# Altium project 最小系统+控制.PrjPcb
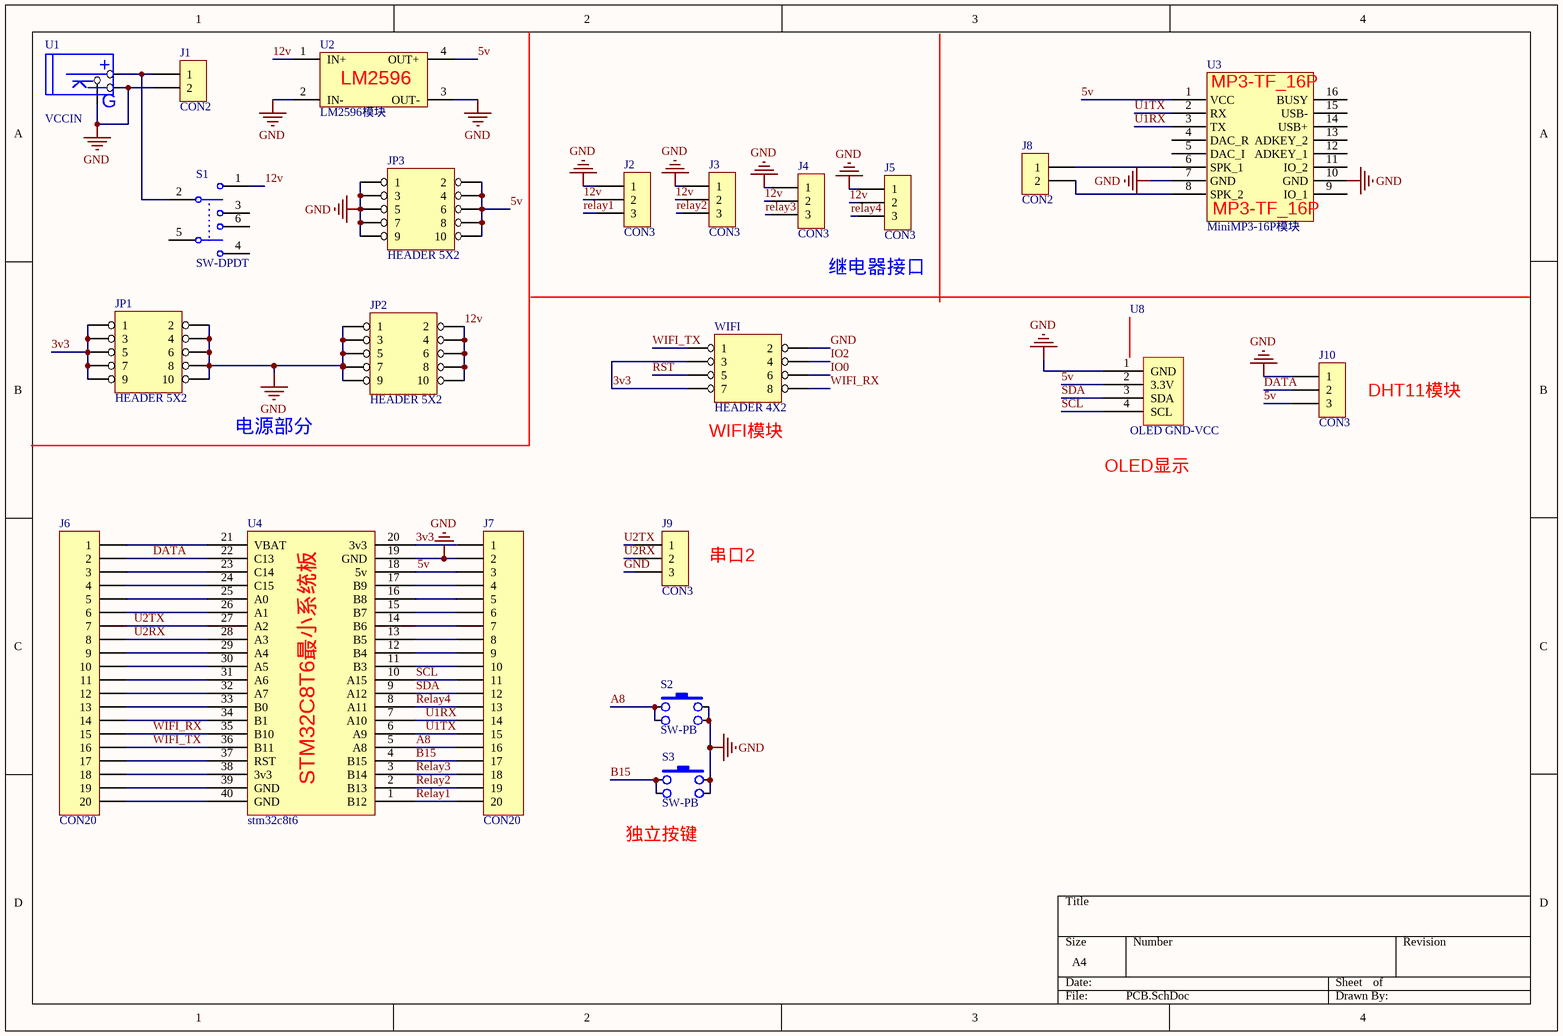
[diagram p0: PCB.SchDoc]
1 sheet, 22 parts. Net scope: global (net labels, ports and power ports of the same name join across sheets).
Board file: 原理图.PcbDoc

## Sheet PCB.SchDoc
size A4

### Parts
J1  CON2  [sip-2]
J2  CON3  [sip-3]
J3  CON3  [sip-3]
J4  CON3  [sip-3]
J5  CON3  [sip-3]
J6  CON20  [sip-20]
J7  CON20  [sip-20]
J8  CON2  [sip-2]
J9  CON3  [sip-3]
J10  CON3  [sip-3]
JP1  HEADER 5X2  [IDC-10]
JP2  HEADER 5X2  [IDC-10]
JP3  HEADER 5X2  [IDC-10]
S1  SW-DPDT  [SWITCH_B1]
S2  SW-PB  [SWPB]
S3  SW-PB  [SWPB]
U1  VCCIN  [VCCIN]
U2  LM2596模块  [LM2596模块]
U3  MiniMP3-16P模块  [MiniMP3模块]
U4  stm32c8t6  [DIP-40]
U8  OLED GND-VCC  [OLED-12864-0.96 模块]
WIFI  HEADER 4X2  [IDC-8]

### Nets
GND: J1.2 J2.1 J3.1 J4.1 J5.1 J7.2 J9.3 J10.1 JP1.2 JP1.4 JP1.6 JP1.8 JP1.10 JP2.1 JP2.3 JP2.5 JP2.7 JP2.9 JP3.1 JP3.3 JP3.5 JP3.7 JP3.9 S2.2 S2.4 S3.2 S3.4 U1.2 U1.3 U2.2(IN-) U2.3(OUT-) U3.7(GND) U3.10(GND) U4.19(GND) U8.1(GND) WIFI.2
3v3: J7.1 JP1.1 JP1.3 JP1.5 JP1.7 JP1.9 U4.20(3v3) WIFI.3 WIFI.7
5v: J7.3 J10.3 JP3.2 JP3.4 JP3.6 JP3.8 JP3.10 U2.4(OUT+) U3.1(VCC) U4.18(5v) U8.2(3.3V)
12v: J2.2 J3.2 J4.2 J5.2 JP2.2 JP2.4 JP2.6 JP2.8 JP2.10 S1.1 U2.1(IN+)
A8: J7.16 S2.1 S2.3 U4.5(A8)
B15: J7.17 S3.1 S3.3 U4.4(B15)
DATA: J6.2 J10.2 U4.22(C13)
IO0: WIFI.6
IO2: WIFI.4
relay1: J2.3 J7.20 U4.1(B12)
relay2: J3.3 J7.19 U4.2(B13)
relay3: J4.3 J7.18 U4.3(B14)
relay4: J5.3 J7.13 U4.8(A11)
RST: WIFI.5
SCL: J7.11 U4.10(A15) U8.4(SCL)
SDA: J7.12 U4.9(A12) U8.3(SDA)
U1RX: J7.14 U3.3(TX) U4.7(A10)
U1TX: J7.15 U3.2(RX) U4.6(A9)
U2RX: J6.8 J9.2 U4.28(A3)
U2TX: J6.7 J9.1 U4.27(A2)
WIFI_RX: J6.15 U4.35(B10) WIFI.8
WIFI_TX: J6.16 U4.36(B11) WIFI.1
NetJ1_1: J1.1 S1.2 U1.1
NetJ6_1: J6.1 U4.21(VBAT)
NetJ6_3: J6.3 U4.23(C14)
NetJ6_4: J6.4 U4.24(C15)
NetJ6_5: J6.5 U4.25(A0)
NetJ6_6: J6.6 U4.26(A1)
NetJ6_9: J6.9 U4.29(A4)
NetJ6_10: J6.10 U4.30(A5)
NetJ6_11: J6.11 U4.31(A6)
NetJ6_12: J6.12 U4.32(A7)
NetJ6_13: J6.13 U4.33(B0)
NetJ6_14: J6.14 U4.34(B1)
NetJ6_17: J6.17 U4.37(RST)
NetJ6_18: J6.18 U4.38(3v3)
NetJ6_19: J6.19 U4.39(GND)
NetJ6_20: J6.20 U4.40(GND)
NetJ7_4: J7.4 U4.17(B9)
NetJ7_5: J7.5 U4.16(B8)
NetJ7_6: J7.6 U4.15(B7)
NetJ7_7: J7.7 U4.14(B6)
NetJ7_8: J7.8 U4.13(B5)
NetJ7_9: J7.9 U4.12(B4)
NetJ7_10: J7.10 U4.11(B3)
NetJ8_1: J8.1 U3.6(SPK_1)
NetJ8_2: J8.2 U3.8(SPK_2)

Not connected (* = marked no-connect by the designer): S1 3 4 5 6; U3 4(DAC_R) 5(DAC_I) 9(IO_1) 11(IO_2) 12(ADKEY_1) 13(ADKEY_2) 14(USB+) 15(USB-) 16(BUSY)

### Notes on the sheet
- 继电器接口
- 电源部分
- (near WIFI) WIFI模块
- (near J10) DHT11模块
- (near U8) OLED显示
- (near J9) 串口2
- (near S3) 独立按键
- (in symbol LM2596模块) LM2596
- (in symbol MiniMP3-16P模块) MP3-TF_16P
- (in symbol stm32c8t6) STM32C8T6最小系统板
- (in symbol VCCIN) +; G

### Library data of the parts
J1 J8 = CON2: Connector
J2-J5 J9 J10 = CON3: Connector
J6 J7 = CON20: Connector
S1 = SW-DPDT: 单刀双掷开关; Published: 24-Mar-1999; LatestRevisionDate: 17-Jul-2002; LatestRevisionNote: Re-released for DXP Platform.; PackageReference: DPDT-6; Publisher: Altium Limited
U1 = VCCIN: pin to pad: 1>2 2>1